# Altium project CameraMainBoard.PrjPcb
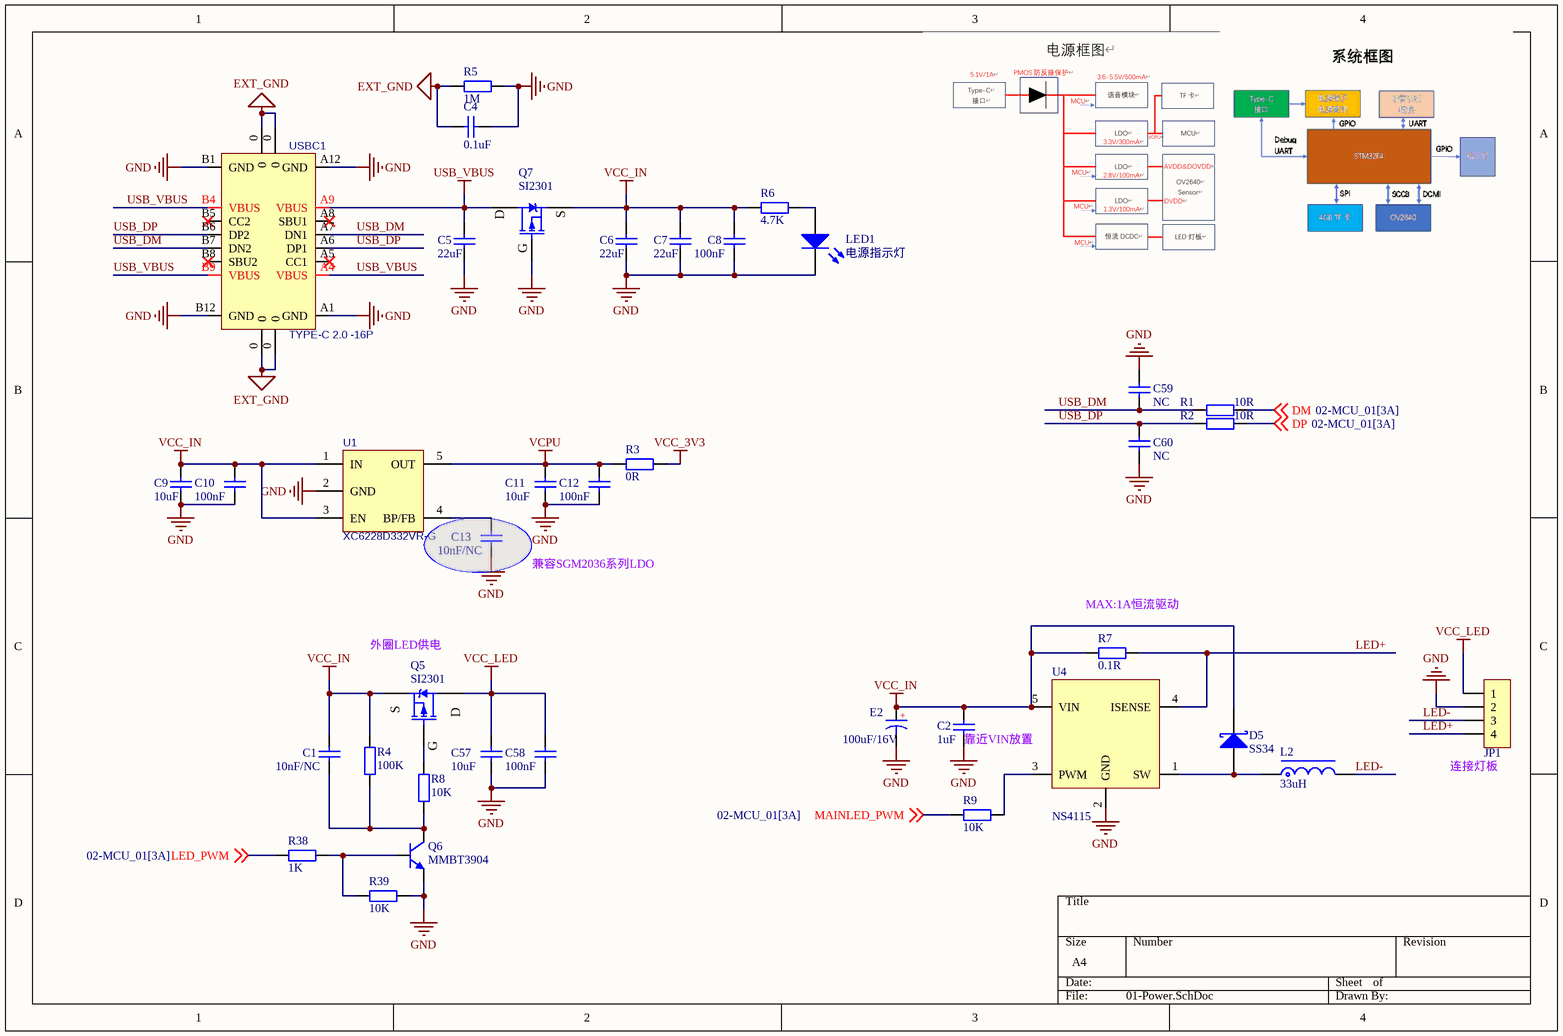
[diagram p0: 01-Power.SchDoc]
5 sheets, 131 parts. Net scope: global (net labels, ports and power ports of the same name join across sheets).
Board file: Camera-M-PCB.PcbDoc
Sheets:
  01-Power.SchDoc
  02-MCU_01.SchDoc
  03-CameraSensor.SchDoc
  04-TFCard_SU03T.SchDoc
  05-MCU_02.SchDoc

## Sheet 01-Power.SchDoc
size A4; SheetNumber: 1; SheetTotal: 5

### Parts
C1  10nF/NC  [C0603_M]
C2  1uF  [C0603_M]
C4  0.1uF  [C0603_M]
C5  22uF  [C0805_M]
C6  22uF  [C0805_M]
C7  22uF  [C0805_M]
C8  100nF  [C0603_M]
C9  10uF  [C0603_M]
C10  100nF  [C0603_M]
C11  10uF  [C0603_M]
C12  100nF  [C0603_M]
C13  10nF/NC  [C0603_M]
C57  10uF  [C0603_M]
C58  100nF  [C0603_M]
C59  NC  [C0402_L]
C60  NC  [C0402_L]
D5  SS34  [SMA]
E2  100uF/16V  [CS 6*6 - B]
JP1  HDR-1X4  [MX1.25-L-4P]  (value not drawn)
L2  33uH  [CDRH74]
LED1  电源指示灯  [LED0603_G]
Q5  SI2301  [SOT23-3N]
Q6  MMBT3904  [SOT23-3N]
Q7  SI2301  [SOT23-3N]
R1  10R  [R0402_M]
R2  10R  [R0402_M]
R3  0R  [R0603_M]
R4  100K  [R0603_M]
R5  1M  [R0603_M]
R6  4.7K  [R0402_M]
R7  0.1R  [R1206_M]
R8  10K  [R0603_M]
R9  10K  [R0603_M]
R38  1K  [R0603_M]
R39  10K  [R0603_M]
U1  XC6228D332VR-G  [SOT-23-5]
U4  NS4115  [SOT89-5M]
USBC1  TYPE-C 2.0 -16P  [USB-C-SMD_16P]

### Nets
EXT_GND: C4.2 R5.2 USBC1.0
GND: C2.1 C4.1 C5.1 C6.1 C7.1 C8.1 C9.1 C10.1 C11.1 C12.1 C13.1 C57.1 C58.1 C59.2 C60.1 E2.2 JP1.2 LED1.2(K) Q6.2(E) Q7.1(G) R5.1 R39.1 U1.2(GND) U4.2(GND) USBC1.A1(GND) USBC1.A12(GND) USBC1.B1(GND) USBC1.B12(GND)
USB_VBUS: C5.2 Q7.3(D) USBC1.A4(VBUS) USBC1.A9(VBUS) USBC1.B4(VBUS) USBC1.B9(VBUS)
VCC_3V3: R3.2
VCC_IN: C1.2 C2.2 C6.2 C7.2 C8.2 C9.2 C10.2 D5.2(K) E2.1 Q5.2(S) Q7.2(S) R4.1 R6.2 R7.1 U1.1(IN) U1.3(EN) U4.5(VIN)
VCC_LED: C57.2 C58.2 JP1.1 Q5.3(D)
VCPU: C11.2 C12.2 R3.1 U1.5(OUT)
DM: R1.1 ; off-sheet DM
DP: R2.1 ; off-sheet DP
LED+: JP1.4 R7.2 U4.4(ISENSE)
LED-: JP1.3 L2.2
LED_PWM: R38.2 ; off-sheet LED_PWM
MAINLED_PWM: R9.1 ; off-sheet MAINLED_PWM
USB_DM: C59.1 R1.2 USBC1.A7(DN1) USBC1.B7(DN2)
USB_DP: C60.2 R2.2 USBC1.A6(DP1) USBC1.B6(DP2)
NetC1_1: C1.1 Q6.3(C) R4.2 R8.2
NetC13_2: C13.2 U1.4(BP/FB)
NetD5_1: D5.1(A) L2.1 U4.1(SW)
NetLED1_1: LED1.1(A) R6.1
NetQ5_1: Q5.1(G) R8.1
NetQ6_1: Q6.1(B) R38.1 R39.2
NetR9_2: R9.2 U4.3(PWM)

Not connected (* = marked no-connect by the designer): USBC1 A5(CC1)* A8(SBU1)* B5(CC2)* B8(SBU2)*

### Notes on the sheet
- 兼容SGM2036系列LDO
- (near Q5) 外圈LED供电
- (near R7) MAX:1A恒流驱动
- (near C2) 靠近VIN放置
- (near JP1) 连接灯板
- (in symbol CS_SMD) +

### Library data of the parts
C1 C2 C4-C13 C57-C60 = C: 贴片电容/MLCC电容; BOM名称: 无极性贴片电容; 当前库版本V2023.8.14 @淘宝卖家:黄晶宝石: 最新版本发布https://item.taobao.com/item.htm?id=566775463719; 联系下单店铺卖家 免费帮你查找封装: 联系下单店铺卖家 免费技术支持
  C1 C13: value: 10nF/NC
  C2: value: 1uF
  C4: value: 0.1uF
  C5-C7: value: 22uF
  C8 C10 C12 C58: value: 100nF
  C9 C11 C57: value: 10uF
  C59 C60: value: NC
D5 = SS34: 肖特基二极管; 属性: 40V/3A; 当前库版本V2023.8.14 @淘宝卖家:黄晶宝石: 最新版本发布https://item.taobao.com/item.htm?id=566775463719; BOM名称: 肖特基二极管
E2 = CS_SMD: 贴片固态电容; 联系下单店铺卖家 免费帮你查找封装: 联系下单店铺卖家 免费技术支持; BOM名称: 贴片固态电容
JP1 = Header 4: 4P连接器; 联系卖家 免费技术支持: 封装库来自淘宝卖家ID：黄晶宝石; BOM名称: 4P连接器
L2 = L-CDRH: CDRH功率屏蔽电感; BOM名称: 功率屏蔽电感; 当前库版本V2023.8.14 @淘宝卖家:黄晶宝石: 最新版本发布https://item.taobao.com/item.htm?id=566775463719; VALUE: 33uH
LED1 = LED: 贴片LED; 封装库来自淘宝卖家：黄晶宝石: 其他店铺购入均为盗版封装库，无更新权益，请立即申请退款，本店现金奖励200~1000元; BOM名称: 贴片LED
Q5 Q7 = SI2301: P沟道 20V/2.8A; BOM名称: P沟道场效应管; 联系下单店铺卖家 免费帮你查找封装: 联系下单店铺卖家 免费技术支持
Q6 = MMBT3904: 高频放大-NPN型; 参数: 40V 0.2A 0.3W 300MHZ; 联系下单店铺卖家 免费帮你查找封装: 联系下单店铺卖家 免费技术支持; BOM名称: 高频放大-NPN型
R1-R7 R9 R38 R39 = R: 贴片电阻; 联系下单店铺卖家 免费帮你查找封装: 联系下单店铺卖家 免费技术支持; BOM名称: 贴片电阻
  R1 R2: value: 10R
  R3: value: 0R
  R4: value: 100K
  R5: value: 1M
  R6: value: 4.7K
  R7: value: 0.1R
  R9 R39: value: 10K
  R38: value: 1K
R8 = R: 贴片电阻; 联系下单店铺卖家 免费帮你查找封装: 联系下单店铺卖家 免费技术支持; value: 1K; BOM名称: 贴片电阻
U1 = SGM2019-1.8YN5G: LDO 1.8V/0.3A; 当前库版本V2023.8.14 @淘宝卖家:黄晶宝石: 最新版本发布https://item.taobao.com/item.htm?id=566775463719; BOM名称: SGM2019-1.8YN5G
U4 = NS4115: NS4115 LED恒流驱动IC，最大输出电流1A，输入支持PWM调光
USBC1 = USB2.0_Type-C_16Pin: USB2.0_Type-C_16Pin母座; 联系下单店铺卖家 免费技术支持: 联系下单店铺卖家 免费帮你查找封装

## Sheet 02-MCU_01.SchDoc
size A4; SheetNumber: 2; SheetTotal: 4
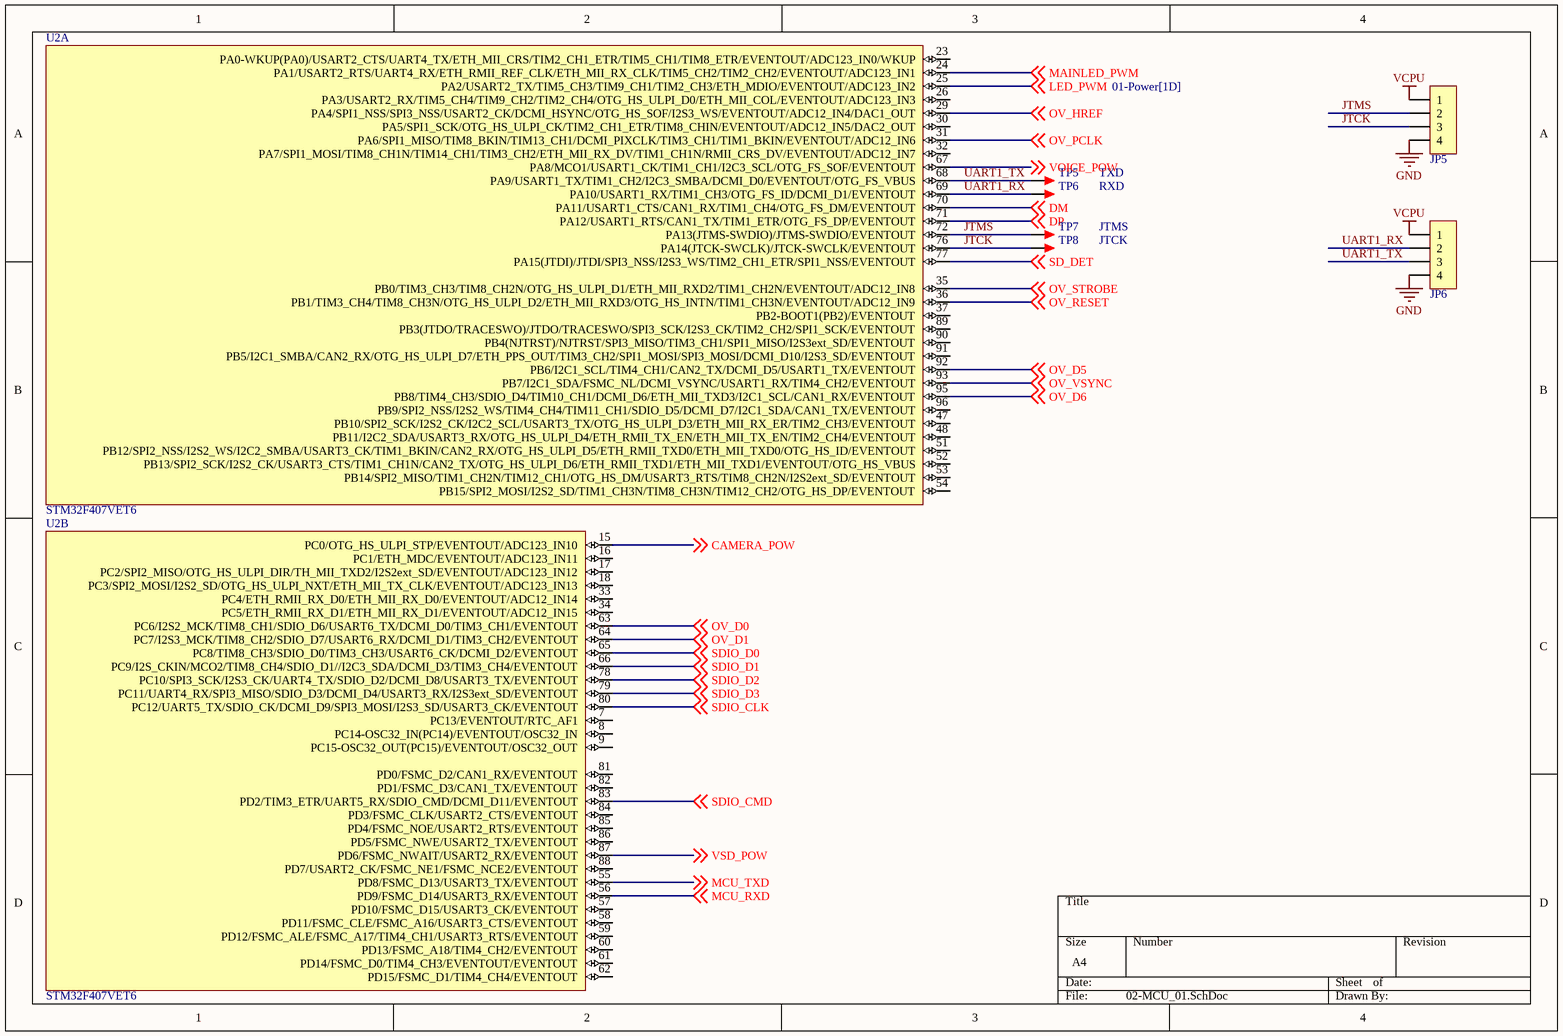
[diagram p1: 02-MCU_01.SchDoc]

### Parts
JP5  HDR-1X4  [MX1.25-LT-4P]  (value not drawn)
JP6  HDR-1X4  [MX1.25-LT-4P]  (value not drawn)
TP5  TXD  [TEST 1.6]
TP6  RXD  [TEST 1.6]
TP7  JTMS  [TEST 1.6]
TP8  JTCK  [TEST 1.6]
U2  STM32F407VET6  [LQFP100_V]  (parts A,B of 5)

### Nets
GND: JP5.4 JP6.4
VCPU: JP5.1 JP6.1
CAMERA_POW: U2.15(PC0/OTG_HS_ULPI_STP/EVENTOUT/ADC123_IN10) ; off-sheet CAMERA_POW
DM: U2.70(PA11/USART1_CTS/CAN1_RX/TIM1_CH4/OTG_FS_DM/EVENTOUT) ; off-sheet DM
DP: U2.71(PA12/USART1_RTS/CAN1_TX/TIM1_ETR/OTG_FS_DP/EVENTOUT) ; off-sheet DP
JTCK: JP5.3 TP8.1 U2.76(PA14(JTCK-SWCLK)/JTCK-SWCLK/EVENTOUT)
JTMS: JP5.2 TP7.1 U2.72(PA13(JTMS-SWDIO)/JTMS-SWDIO/EVENTOUT)
LED_PWM: U2.25(PA2/USART2_TX/TIM5_CH3/TIM9_CH1/TIM2_CH3/ETH_MDIO/EVENTOUT/ADC123_IN2) ; off-sheet LED_PWM
MAINLED_PWM: U2.24(PA1/USART2_RTS/UART4_RX/ETH_RMII_REF_CLK/ETH_MII_RX_CLK/TIM5_CH2/TIM2_CH2/EVENTOUT/ADC123_IN1) ; off-sheet MAINLED_PWM
MCU_RXD: U2.56(PD9/FSMC_D14/USART3_RX/EVENTOUT) ; off-sheet MCU_RXD
MCU_TXD: U2.55(PD8/FSMC_D13/USART3_TX/EVENTOUT) ; off-sheet MCU_TXD
OV_D0: U2.63(PC6/I2S2_MCK/TIM8_CH1/SDIO_D6/USART6_TX/DCMI_D0/TIM3_CH1/EVENTOUT) ; off-sheet OV_D0
OV_D1: U2.64(PC7/I2S3_MCK/TIM8_CH2/SDIO_D7/USART6_RX/DCMI_D1/TIM3_CH2/EVENTOUT) ; off-sheet OV_D1
OV_D5: U2.92(PB6/I2C1_SCL/TIM4_CH1/CAN2_TX/DCMI_D5/USART1_TX/EVENTOUT) ; off-sheet OV_D5
OV_D6: U2.95(PB8/TIM4_CH3/SDIO_D4/TIM10_CH1/DCMI_D6/ETH_MII_TXD3/I2C1_SCL/CAN1_RX/EVENTOUT) ; off-sheet OV_D6
OV_HREF: U2.29(PA4/SPI1_NSS/SPI3_NSS/USART2_CK/DCMI_HSYNC/OTG_HS_SOF/I2S3_WS/EVENTOUT/ADC12_IN4/DAC1_OUT) ; off-sheet OV_HREF
OV_PCLK: U2.31(PA6/SPI1_MISO/TIM8_BKIN/TIM13_CH1/DCMI_PIXCLK/TIM3_CH1/TIM1_BKIN/EVENTOUT/ADC12_IN6) ; off-sheet OV_PCLK
OV_RESET: U2.36(PB1/TIM3_CH4/TIM8_CH3N/OTG_HS_ULPI_D2/ETH_MII_RXD3/OTG_HS_INTN/TIM1_CH3N/EVENTOUT/ADC12_IN9) ; off-sheet OV_RESET
OV_STROBE: U2.35(PB0/TIM3_CH3/TIM8_CH2N/OTG_HS_ULPI_D1/ETH_MII_RXD2/TIM1_CH2N/EVENTOUT/ADC12_IN8) ; off-sheet OV_STROBE
OV_VSYNC: U2.93(PB7/I2C1_SDA/FSMC_NL/DCMI_VSYNC/USART1_RX/TIM4_CH2/EVENTOUT) ; off-sheet OV_VSYNC
SD_DET: U2.77(PA15(JTDI)/JTDI/SPI3_NSS/I2S3_WS/TIM2_CH1_ETR/SPI1_NSS/EVENTOUT) ; off-sheet SD_DET
SDIO_CLK: U2.80(PC12/UART5_TX/SDIO_CK/DCMI_D9/SPI3_MOSI/I2S3_SD/USART3_CK/EVENTOUT) ; off-sheet SDIO_CLK
SDIO_CMD: U2.83(PD2/TIM3_ETR/UART5_RX/SDIO_CMD/DCMI_D11/EVENTOUT) ; off-sheet SDIO_CMD
SDIO_D0: U2.65(PC8/TIM8_CH3/SDIO_D0/TIM3_CH3/USART6_CK/DCMI_D2/EVENTOUT) ; off-sheet SDIO_D0
SDIO_D1: U2.66(PC9/I2S_CKIN/MCO2/TIM8_CH4/SDIO_D1//I2C3_SDA/DCMI_D3/TIM3_CH4/EVENTOUT) ; off-sheet SDIO_D1
SDIO_D2: U2.78(PC10/SPI3_SCK/I2S3_CK/UART4_TX/SDIO_D2/DCMI_D8/USART3_TX/EVENTOUT) ; off-sheet SDIO_D2
SDIO_D3: U2.79(PC11/UART4_RX/SPI3_MISO/SDIO_D3/DCMI_D4/USART3_RX/I2S3ext_SD/EVENTOUT) ; off-sheet SDIO_D3
UART1_RX: JP6.2 TP6.1 U2.69(PA10/USART1_RX/TIM1_CH3/OTG_FS_ID/DCMI_D1/EVENTOUT)
UART1_TX: JP6.3 TP5.1 U2.68(PA9/USART1_TX/TIM1_CH2/I2C3_SMBA/DCMI_D0/EVENTOUT/OTG_FS_VBUS)
VOICE_POW: U2.67(PA8/MCO1/USART1_CK/TIM1_CH1/I2C3_SCL/OTG_FS_SOF/EVENTOUT) ; off-sheet VOICE_POW
VSD_POW: U2.87(PD6/FSMC_NWAIT/USART2_RX/EVENTOUT) ; off-sheet VSD_POW

Not connected (* = marked no-connect by the designer): U2 7(PC13/EVENTOUT/RTC_AF1) 8(PC14-OSC32_IN(PC14)/EVENTOUT/OSC32_IN) 9(PC15-OSC32_OUT(PC15)/EVENTOUT/OSC32_OUT) 16(PC1/ETH_MDC/EVENTOUT/ADC123_IN11) 17(PC2/SPI2_MISO/OTG_HS_ULPI_DIR/TH_MII_TXD2/I2S2ext_SD/EVENTOUT/ADC123_IN12) 18(PC3/SPI2_MOSI/I2S2_SD/OTG_HS_ULPI_NXT/ETH_MII_TX_CLK/EVENTOUT/ADC123_IN13) 23(PA0-WKUP(PA0)/USART2_CTS/UART4_TX/ETH_MII_CRS/TIM2_CH1_ETR/TIM5_CH1/TIM8_ETR/EVENTOUT/ADC123_IN0/WKUP) 26(PA3/USART2_RX/TIM5_CH4/TIM9_CH2/TIM2_CH4/OTG_HS_ULPI_D0/ETH_MII_COL/EVENTOUT/ADC123_IN3) 30(PA5/SPI1_SCK/OTG_HS_ULPI_CK/TIM2_CH1_ETR/TIM8_CHIN/EVENTOUT/ADC12_IN5/DAC2_OUT) 32(PA7/SPI1_MOSI/TIM8_CH1N/TIM14_CH1/TIM3_CH2/ETH_MII_RX_DV/TIM1_CH1N/RMII_CRS_DV/EVENTOUT/ADC12_IN7) 33(PC4/ETH_RMII_RX_D0/ETH_MII_RX_D0/EVENTOUT/ADC12_IN14) 34(PC5/ETH_RMII_RX_D1/ETH_MII_RX_D1/EVENTOUT/ADC12_IN15) 37(PB2-BOOT1(PB2)/EVENTOUT) 47(PB10/SPI2_SCK/I2S2_CK/I2C2_SCL/USART3_TX/OTG_HS_ULPI_D3/ETH_MII_RX_ER/TIM2_CH3/EVENTOUT) 48(PB11/I2C2_SDA/USART3_RX/OTG_HS_ULPI_D4/ETH_RMII_TX_EN/ETH_MII_TX_EN/TIM2_CH4/EVENTOUT) 51(PB12/SPI2_NSS/I2S2_WS/I2C2_SMBA/USART3_CK/TIM1_BKIN/CAN2_RX/OTG_HS_ULPI_D5/ETH_RMII_TXD0/ETH_MII_TXD0/OTG_HS_ID/EVENTOUT) 52(PB13/SPI2_SCK/I2S2_CK/USART3_CTS/TIM1_CH1N/CAN2_TX/OTG_HS_ULPI_D6/ETH_RMII_TXD1/ETH_MII_TXD1/EVENTOUT/OTG_HS_VBUS) 53(PB14/SPI2_MISO/TIM1_CH2N/TIM12_CH1/OTG_HS_DM/USART3_RTS/TIM8_CH2N/I2S2ext_SD/EVENTOUT) 54(PB15/SPI2_MOSI/I2S2_SD/TIM1_CH3N/TIM8_CH3N/TIM12_CH2/OTG_HS_DP/EVENTOUT) 57(PD10/FSMC_D15/USART3_CK/EVENTOUT) 58(PD11/FSMC_CLE/FSMC_A16/USART3_CTS/EVENTOUT) 59(PD12/FSMC_ALE/FSMC_A17/TIM4_CH1/USART3_RTS/EVENTOUT) 60(PD13/FSMC_A18/TIM4_CH2/EVENTOUT) 61(PD14/FSMC_D0/TIM4_CH3/EVENTOUT/EVENTOUT) 62(PD15/FSMC_D1/TIM4_CH4/EVENTOUT) 81(PD0/FSMC_D2/CAN1_RX/EVENTOUT) 82(PD1/FSMC_D3/CAN1_TX/EVENTOUT) 84(PD3/FSMC_CLK/USART2_CTS/EVENTOUT) 85(PD4/FSMC_NOE/USART2_RTS/EVENTOUT) 86(PD5/FSMC_NWE/USART2_TX/EVENTOUT) 88(PD7/USART2_CK/FSMC_NE1/FSMC_NCE2/EVENTOUT) 89(PB3(JTDO/TRACESWO)/JTDO/TRACESWO/SPI3_SCK/I2S3_CK/TIM2_CH2/SPI1_SCK/EVENTOUT) 90(PB4(NJTRST)/NJTRST/SPI3_MISO/TIM3_CH1/SPI1_MISO/I2S3ext_SD/EVENTOUT) 91(PB5/I2C1_SMBA/CAN2_RX/OTG_HS_ULPI_D7/ETH_PPS_OUT/TIM3_CH2/SPI1_MOSI/SPI3_MOSI/DCMI_D10/I2S3_SD/EVENTOUT) 96(PB9/SPI2_NSS/I2S2_WS/TIM4_CH4/TIM11_CH1/SDIO_D5/DCMI_D7/I2C1_SDA/CAN1_TX/EVENTOUT)

### Library data of the parts
JP5 JP6 = Header 4: 4P连接器; 联系卖家 免费技术支持: 封装库来自淘宝卖家ID：黄晶宝石; BOM名称: 4P连接器
TP5-TP8 = TEST: 测试点; 联系下单店铺卖家 免费技术支持: 联系下单店铺卖家 免费帮你查找封装; BOM名称: 测试点
U2 = STM32F407VET6: ARM Cortex-M4 32b MCU+FPU, 210DMIP, 512 kB Flash, 192+4 kB RAM, Camera, 82 I/Os, 100-pin LQFP, -40 to +85癈, Tray; Internal RAM: 192kB; Operating Frequency (Processor Speed): 168MHz; A/D Converter: 16x12-bit; D/A Converter: 2x12-bit; 16-bit Timers (IC/OC/PWM): 12x16-bit(24/24/30); 32-bit Timer (IC/OC/PWM): 2x32-bit (8/8/8); Other Timer Functions: 2xWDG, RTC, 24-bit down counter; Serial Interface: 3xSPI/2xI2S/2xI2C/3xUSART(IrDa, ISO7816)/3xUART/2xUSB OTG FS/HS, 2xCAN/Ethernet MAC10/100, SDIO; DatasheetVersion: rev2, Jan-2012; PackageVersion: 2012; PackageReference: LQFP100; PackageDescription: 100-Pin Low Profile Quad Flat Package, 14x14 mm Body, 0.5 mm Pitch; ComponentLink1Description: Manufacturer URL; ComponentLink1URL: http://www.st.com/; ComponentLink2Description: STM32F405/7 Datasheet; ComponentLink2URL: http://www.st.com/internet/com/TECHNICAL_RESOURCES/TECHNICAL_LITERATURE/DATASHEET/DM00037051.pdf; ComponentLink3Description: STM32F4 Web Page; ComponentLink3URL: http://www.st.com/internet/mcu/subclass/1521.jsp

## Sheet 03-CameraSensor.SchDoc
size A4; SheetNumber: 3; SheetTotal: 5
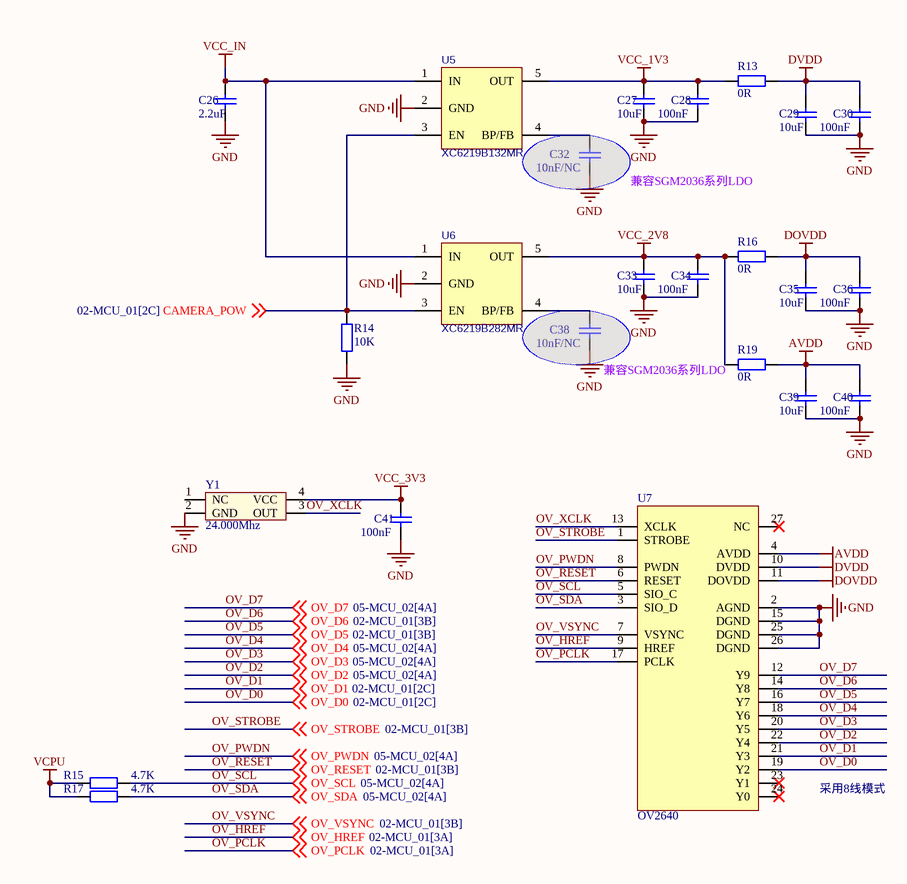
[diagram p2: 03-CameraSensor.SchDoc]

### Parts
C26  2.2uF  [C0603_M]
C27  10uF  [C0603_M]
C28  100nF  [C0603_M]
C29  10uF  [C0603_M]
C30  100nF  [C0603_M]
C32  10nF/NC  [C0603_M]
C33  10uF  [C0603_M]
C34  100nF  [C0603_M]
C35  10uF  [C0603_M]
C36  100nF  [C0603_M]
C38  10nF/NC  [C0603_M]
C39  10uF  [C0603_M]
C40  100nF  [C0603_M]
C41  100nF  [C0603_M]
R13  0R  [R0603_M]
R14  10K  [R0603_M]
R15  4.7K  [R0402_M]
R16  0R  [R0603_M]
R17  4.7K  [R0402_M]
R19  0R  [R0603_M]
U5  XC6219B132MR  [SOT-23-5]
U6  XC6219B282MR  [SOT-23-5]
U7  OV2640  [OV2640-24]
Y1  24.000Mhz  [XTAL3225]

### Nets
AVDD: C39.2 C40.2 R19.2 U7.4(AVDD)
DOVDD: C35.2 C36.2 R16.2 U7.11(DOVDD)
DVDD: C29.2 C30.2 R13.2 U7.10(DVDD)
GND: C26.1 C27.1 C28.1 C29.1 C30.1 C32.1 C33.1 C34.1 C35.1 C36.1 C38.1 C39.1 C40.1 C41.1 R14.1 U5.2(GND) U6.2(GND) U7.2(AGND) U7.15(DGND) U7.25(DGND) U7.26(DGND) Y1.2(GND)
VCC_1V3: C27.2 C28.2 R13.1 U5.5(OUT)
VCC_2V8: C33.2 C34.2 R16.1 R19.1 U6.5(OUT)
VCC_3V3: C41.2 Y1.4(VCC)
VCC_IN: C26.2 U5.1(IN) U6.1(IN)
VCPU: R15.2 R17.2
CAMERA_POW: R14.2 U5.3(EN) U6.3(EN) ; off-sheet CAMERA_POW
OV_D0: U7.19(Y2) ; off-sheet OV_D0
OV_D1: U7.21(Y3) ; off-sheet OV_D1
OV_D2: U7.22(Y4) ; off-sheet OV_D2
OV_D3: U7.20(Y5) ; off-sheet OV_D3
OV_D4: U7.18(Y6) ; off-sheet OV_D4
OV_D5: U7.16(Y7) ; off-sheet OV_D5
OV_D6: U7.14(Y8) ; off-sheet OV_D6
OV_D7: U7.12(Y9) ; off-sheet OV_D7
OV_HREF: U7.9(HREF) ; off-sheet OV_HREF
OV_PCLK: U7.17(PCLK) ; off-sheet OV_PCLK
OV_PWDN: U7.8(PWDN) ; off-sheet OV_PWDN
OV_RESET: U7.6(RESET) ; off-sheet OV_RESET
OV_SCL: R15.1 U7.5(SIO_C) ; off-sheet OV_SCL
OV_SDA: R17.1 U7.3(SIO_D) ; off-sheet OV_SDA
OV_STROBE: U7.1(STROBE) ; off-sheet OV_STROBE
OV_VSYNC: U7.7(VSYNC) ; off-sheet OV_VSYNC
OV_XCLK: U7.13(XCLK) Y1.3(OUT)
NetC32_2: C32.2 U5.4(BP/FB)
NetC38_2: C38.2 U6.4(BP/FB)

Not connected (* = marked no-connect by the designer): U7 23(Y1)* 24(Y0)* 27(NC)*; Y1 1(NC)

### Notes on the sheet
- 兼容SGM2036系列LDO
- (near C38) 兼容SGM2036系列LDO
- 采用8线模式

### Library data of the parts
C26-C30 C32-C36 C38-C41 = C: as C1 on sheet 01-Power
  C26: value: 2.2uF
  C27 C29 C33 C35 C39: value: 10uF
  C28 C30 C34 C36 C40 C41: value: 100nF
  C32 C38: value: 10nF/NC
R13-R17 R19 = R: 贴片电阻; 联系下单店铺卖家 免费帮你查找封装: 联系下单店铺卖家 免费技术支持; BOM名称: 贴片电阻
  R13 R16 R19: value: 0R
  R14: value: 10K
  R15 R17: value: 4.7K
U5 U6 = SGM2019-1.8YN5G: as U1 on sheet 01-Power; BOM名称: SGM2019-1.8YN5G
Y1 = XTAL_S: 有源晶振

## Sheet 04-TFCard_SU03T.SchDoc
size A4; SheetNumber: 3; SheetTotal: 4
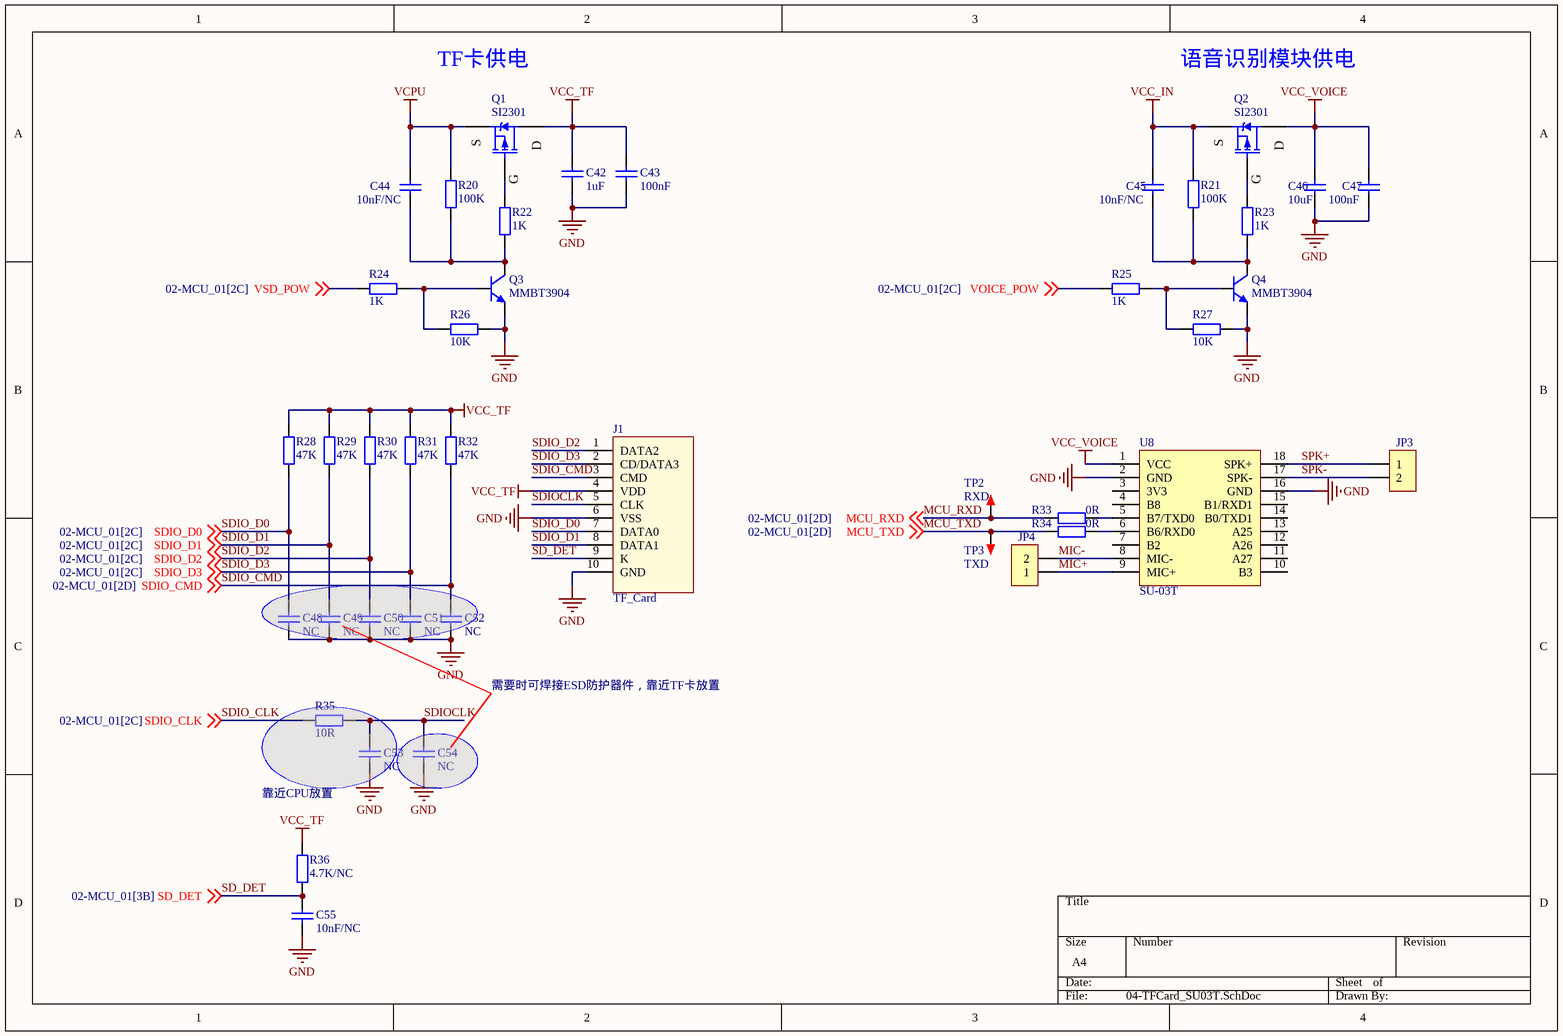
[diagram p3: 04-TFCard_SU03T.SchDoc]

### Parts
C42  1uF  [C0603_M]
C43  100nF  [C0603_M]
C44  10nF/NC  [C0603_M]
C45  10nF/NC  [C0603_M]
C46  10uF  [C0603_M]
C47  100nF  [C0603_M]
C48  NC  [C0402_L]
C49  NC  [C0402_L]
C50  NC  [C0402_L]
C51  NC  [C0402_L]
C52  NC  [C0402_L]
C53  NC  [C0603_M]
C54  NC  [C0402_L]
C55  10nF/NC  [C0603_M]
J1  TF_Card  [Micro SD]
JP3  HDR-1X2  [MX1.25-WT-2P]  (value not drawn)
JP4  HDR-1X2  [MX1.25-WT-2P]  (value not drawn)
Q1  SI2301  [SOT23-3N]
Q2  SI2301  [SOT23-3N]
Q3  MMBT3904  [SOT23-3N]
Q4  MMBT3904  [SOT23-3N]
R20  100K  [R0603_M]
R21  100K  [R0603_M]
R22  1K  [R0603_M]
R23  1K  [R0603_M]
R24  1K  [R0603_M]
R25  1K  [R0603_M]
R26  10K  [R0603_M]
R27  10K  [R0603_M]
R28  47K  [R0603_M]
R29  47K  [R0603_M]
R30  47K  [R0603_M]
R31  47K  [R0603_M]
R32  47K  [R0603_M]
R33  0R  [R0603_M]
R34  0R  [R0603_M]
R35  10R  [R0603_M]
R36  4.7K/NC  [R0603_M]
TP2  RXD  [TEST 1.6]
TP3  TXD  [TEST 1.6]
U8  SU-03T  [SU-03T]

### Nets
GND: C42.1 C43.1 C46.1 C47.1 C48.1 C49.1 C50.1 C51.1 C52.1 C53.1 C54.1 C55.1 J1.6(VSS) J1.10(GND) Q3.2(E) Q4.2(E) R26.1 R27.1 U8.2(GND) U8.16(GND)
VCC_IN: C45.2 Q2.2(S) R21.1
VCC_TF: C42.2 C43.2 J1.4(VDD) Q1.3(D) R28.1 R29.1 R30.1 R31.1 R32.1 R36.1
VCC_VOICE: C46.2 C47.2 Q2.3(D) U8.1(VCC)
VCPU: C44.2 Q1.2(S) R20.1
MCU_RXD: R33.2 TP2.1 ; off-sheet MCU_RXD
MCU_TXD: R34.2 TP3.1 ; off-sheet MCU_TXD
MIC+: JP4.1 U8.9(MIC+)
MIC-: JP4.2 U8.8(MIC-)
SD_DET: C55.2 J1.9(K) R36.2 ; off-sheet SD_DET
SDIO_CLK: R35.2 ; off-sheet SDIO_CLK
SDIO_CMD: C52.2 J1.3(CMD) R32.2 ; off-sheet SDIO_CMD
SDIO_D0: C48.2 J1.7(DATA0) R28.2 ; off-sheet SDIO_D0
SDIO_D1: C49.2 J1.8(DATA1) R29.2 ; off-sheet SDIO_D1
SDIO_D2: C50.2 J1.1(DATA2) R30.2 ; off-sheet SDIO_D2
SDIO_D3: C51.2 J1.2(CD/DATA3) R31.2 ; off-sheet SDIO_D3
SDIOCLK: C53.2 C54.2 J1.5(CLK) R35.1
SPK+: JP3.1 U8.18(SPK+)
SPK-: JP3.2 U8.17(SPK-)
VOICE_POW: R25.2 ; off-sheet VOICE_POW
VSD_POW: R24.2 ; off-sheet VSD_POW
NetC44_1: C44.1 Q3.3(C) R20.2 R22.2
NetC45_1: C45.1 Q4.3(C) R21.2 R23.2
NetQ1_1: Q1.1(G) R22.1
NetQ2_1: Q2.1(G) R23.1
NetQ3_1: Q3.1(B) R24.1 R26.2
NetQ4_1: Q4.1(B) R25.1 R27.2
NetR33_1: R33.1 U8.5(B7/TXD0)
NetR34_1: R34.1 U8.6(B6/RXD0)

Not connected (* = marked no-connect by the designer): U8 3(3V3) 4(B8) 7(B2) 10(B3) 11(A27) 12(A26) 13(A25) 14(B0/TXD1) 15(B1/RXD1)

### Notes on the sheet
- TF卡供电
- 语音识别模块供电
- 需要时可焊接ESD防护器件，靠近TF卡放置
- 靠近CPU放置

### Library data of the parts
C42-C55 = C: as C1 on sheet 01-Power
  C42: value: 1uF
  C43 C47: value: 100nF
  C44 C45 C55: value: 10nF/NC
  C46: value: 10uF
  C48-C54: value: NC
J1 = TF_Card: TF卡座; 当前库版本V2023.8.14 @淘宝卖家:黄晶宝石: 最新版本发布https://item.taobao.com/item.htm?id=566775463719; BOM名称: TF卡座
JP3 JP4 = Header 2: 2P连接器; 联系卖家 免费技术支持: 封装库来自淘宝卖家ID：黄晶宝石; BOM名称: 2P连接器
Q1 Q2 = SI2301: as Q5 on sheet 01-Power
Q3 Q4 = MMBT3904: as Q6 on sheet 01-Power; BOM名称: 高频放大-NPN型
R20-R36 = R: 贴片电阻; 联系下单店铺卖家 免费帮你查找封装: 联系下单店铺卖家 免费技术支持; BOM名称: 贴片电阻
  R20 R21: value: 100K
  R22-R25: value: 1K
  R26 R27: value: 10K
  R28-R32: value: 47K
  R33 R34: value: 0R
  R35: value: 10R
  R36: value: 4.7K/NC
TP2 TP3 = TEST: 测试点; 联系下单店铺卖家 免费技术支持: 联系下单店铺卖家 免费帮你查找封装; BOM名称: 测试点
U8 = SU-03T: 离线语音识别模块V1.8

## Sheet 05-MCU_02.SchDoc
size A4; SheetNumber: 4; SheetTotal: 5
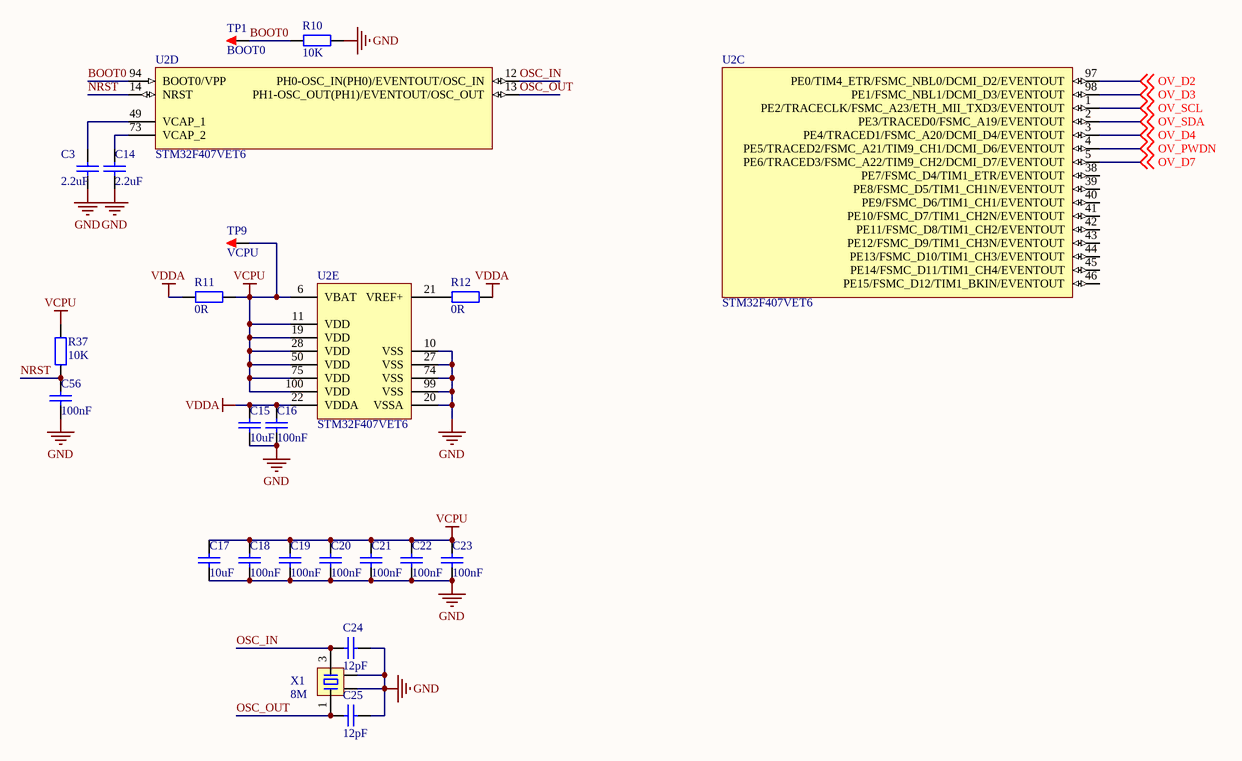
[diagram p4: 05-MCU_02.SchDoc]

### Parts
C3  2.2uF  [C0603_M]
C14  2.2uF  [C0603_M]
C15  10uF  [C0603_M]
C16  100nF  [C0603_M]
C17  10uF  [C0603_M]
C18  100nF  [C0603_M]
C19  100nF  [C0603_M]
C20  100nF  [C0603_M]
C21  100nF  [C0603_M]
C22  100nF  [C0603_M]
C23  100nF  [C0603_M]
C24  12pF  [C0603_M]
C25  12pF  [C0603_M]
C56  100nF  [C0603_M]
R10  10K  [R0603_M]
R11  0R  [R0603_M]
R12  0R  [R0603_M]
R37  10K  [R0603_M]
TP1  BOOT0  [TEST 1.6]
TP9  VCPU  [TEST 1.6]
U2  STM32F407VET6  [LQFP100_V]  (parts C,D,E of 5)
X1  8M  [XTAL-3225-4P]

### Nets
GND: C3.2 C14.2 C15.2 C16.2 C17.2 C18.2 C19.2 C20.2 C21.2 C22.2 C23.2 C24.2 C25.2 C56.2 R10.1 U2.10(VSS) U2.20(VSSA) U2.27(VSS) U2.74(VSS) U2.99(VSS) X1.2 X1.4
VCPU: C17.1 C18.1 C19.1 C20.1 C21.1 C22.1 C23.1 R11.1 R37.2 TP9.1 U2.6(VBAT) U2.11(VDD) U2.19(VDD) U2.28(VDD) U2.50(VDD) U2.75(VDD) U2.100(VDD)
VDDA: C15.1 C16.1 R11.2 R12.1 U2.22(VDDA)
BOOT0: R10.2 TP1.1 U2.94(BOOT0/VPP)
NRST: C56.1 R37.1 U2.14(NRST)
OSC_IN: C24.1 U2.12(PH0-OSC_IN(PH0)/EVENTOUT/OSC_IN) X1.3
OSC_OUT: C25.1 U2.13(PH1-OSC_OUT(PH1)/EVENTOUT/OSC_OUT) X1.1
OV_D2: U2.97(PE0/TIM4_ETR/FSMC_NBL0/DCMI_D2/EVENTOUT) ; off-sheet OV_D2
OV_D3: U2.98(PE1/FSMC_NBL1/DCMI_D3/EVENTOUT) ; off-sheet OV_D3
OV_D4: U2.3(PE4/TRACED1/FSMC_A20/DCMI_D4/EVENTOUT) ; off-sheet OV_D4
OV_D7: U2.5(PE6/TRACED3/FSMC_A22/TIM9_CH2/DCMI_D7/EVENTOUT) ; off-sheet OV_D7
OV_PWDN: U2.4(PE5/TRACED2/FSMC_A21/TIM9_CH1/DCMI_D6/EVENTOUT) ; off-sheet OV_PWDN
OV_SCL: U2.1(PE2/TRACECLK/FSMC_A23/ETH_MII_TXD3/EVENTOUT) ; off-sheet OV_SCL
OV_SDA: U2.2(PE3/TRACED0/FSMC_A19/EVENTOUT) ; off-sheet OV_SDA
NetC3_1: C3.1 U2.49(VCAP_1)
NetC14_1: C14.1 U2.73(VCAP_2)
NetR12_2: R12.2 U2.21(VREF+)

Not connected (* = marked no-connect by the designer): U2 38(PE7/FSMC_D4/TIM1_ETR/EVENTOUT) 39(PE8/FSMC_D5/TIM1_CH1N/EVENTOUT) 40(PE9/FSMC_D6/TIM1_CH1/EVENTOUT) 41(PE10/FSMC_D7/TIM1_CH2N/EVENTOUT) 42(PE11/FSMC_D8/TIM1_CH2/EVENTOUT) 43(PE12/FSMC_D9/TIM1_CH3N/EVENTOUT) 44(PE13/FSMC_D10/TIM1_CH3/EVENTOUT) 45(PE14/FSMC_D11/TIM1_CH4/EVENTOUT) 46(PE15/FSMC_D12/TIM1_BKIN/EVENTOUT)

### Library data of the parts
C3 C14-C25 C56 = C: as C1 on sheet 01-Power
  C3 C14: value: 2.2uF
  C15 C17: value: 10uF
  C16 C18-C23 C56: value: 100nF
  C24 C25: value: 12pF
R10-R12 R37 = R: 贴片电阻; 联系下单店铺卖家 免费帮你查找封装: 联系下单店铺卖家 免费技术支持; BOM名称: 贴片电阻
  R10 R37: value: 10K
  R11 R12: value: 0R
TP1 TP9 = TEST: 测试点; 联系下单店铺卖家 免费技术支持: 联系下单店铺卖家 免费帮你查找封装; BOM名称: 测试点
U2 = STM32F407VET6: as U2 on sheet 02-MCU_01; DatasheetVersion: rev2, Jan-2012; PackageVersion: 2012; PackageReference: LQFP100; PackageDescription: 100-Pin Low Profile Quad Flat Package, 14x14 mm Body, 0.5 mm Pitch; ComponentLink1Description: Manufacturer URL; ComponentLink1URL: http://www.st.com/; ComponentLink2Description: STM32F405/7 Datasheet; ComponentLink2URL: http://www.st.com/internet/com/TECHNICAL_RESOURCES/TECHNICAL_LITERATURE/DATASHEET/DM00037051.pdf; ComponentLink3Description: STM32F4 Web Page; ComponentLink3URL: http://www.st.com/internet/mcu/subclass/1521.jsp
X1 = XTAL-4P: 4脚无源晶振(谐振器）; 联系下单店铺卖家 免费帮你查找封装: 联系下单店铺卖家 免费技术支持; BOM名称: 4脚无源晶振(谐振器）

## Nets that join several sheets
GND: 01-Power (28 pins), 02-MCU_01 (JP5.4 JP6.4), 03-CameraSensor (22 pins), 04-TFCard_SU03T (20 pins), 05-MCU_02 (22 pins)
VCC_3V3: 01-Power (R3.2), 03-CameraSensor (C41.2 Y1.4)
VCC_IN: 01-Power (17 pins), 03-CameraSensor (C26.2 U5.1 U6.1), 04-TFCard_SU03T (C45.2 Q2.2 R21.1)
VCPU: 01-Power (C11.2 C12.2 R3.1 U1.5), 02-MCU_01 (JP5.1 JP6.1), 03-CameraSensor (R15.2 R17.2), 04-TFCard_SU03T (C44.2 Q1.2 R20.1), 05-MCU_02 (17 pins)
CAMERA_POW: 02-MCU_01 (U2.15), 03-CameraSensor (R14.2 U5.3 U6.3)
DM: 01-Power (R1.1), 02-MCU_01 (U2.70)
DP: 01-Power (R2.1), 02-MCU_01 (U2.71)
LED_PWM: 01-Power (R38.2), 02-MCU_01 (U2.25)
MAINLED_PWM: 01-Power (R9.1), 02-MCU_01 (U2.24)
MCU_RXD: 02-MCU_01 (U2.56), 04-TFCard_SU03T (R33.2 TP2.1)
MCU_TXD: 02-MCU_01 (U2.55), 04-TFCard_SU03T (R34.2 TP3.1)
OV_D0: 02-MCU_01 (U2.63), 03-CameraSensor (U7.19)
OV_D1: 02-MCU_01 (U2.64), 03-CameraSensor (U7.21)
OV_D2: 03-CameraSensor (U7.22), 05-MCU_02 (U2.97)
OV_D3: 03-CameraSensor (U7.20), 05-MCU_02 (U2.98)
OV_D4: 03-CameraSensor (U7.18), 05-MCU_02 (U2.3)
OV_D5: 02-MCU_01 (U2.92), 03-CameraSensor (U7.16)
OV_D6: 02-MCU_01 (U2.95), 03-CameraSensor (U7.14)
OV_D7: 03-CameraSensor (U7.12), 05-MCU_02 (U2.5)
OV_HREF: 02-MCU_01 (U2.29), 03-CameraSensor (U7.9)
OV_PCLK: 02-MCU_01 (U2.31), 03-CameraSensor (U7.17)
OV_PWDN: 03-CameraSensor (U7.8), 05-MCU_02 (U2.4)
OV_RESET: 02-MCU_01 (U2.36), 03-CameraSensor (U7.6)
OV_SCL: 03-CameraSensor (R15.1 U7.5), 05-MCU_02 (U2.1)
OV_SDA: 03-CameraSensor (R17.1 U7.3), 05-MCU_02 (U2.2)
OV_STROBE: 02-MCU_01 (U2.35), 03-CameraSensor (U7.1)
OV_VSYNC: 02-MCU_01 (U2.93), 03-CameraSensor (U7.7)
SD_DET: 02-MCU_01 (U2.77), 04-TFCard_SU03T (C55.2 J1.9 R36.2)
SDIO_CLK: 02-MCU_01 (U2.80), 04-TFCard_SU03T (R35.2)
SDIO_CMD: 02-MCU_01 (U2.83), 04-TFCard_SU03T (C52.2 J1.3 R32.2)
SDIO_D0: 02-MCU_01 (U2.65), 04-TFCard_SU03T (C48.2 J1.7 R28.2)
SDIO_D1: 02-MCU_01 (U2.66), 04-TFCard_SU03T (C49.2 J1.8 R29.2)
SDIO_D2: 02-MCU_01 (U2.78), 04-TFCard_SU03T (C50.2 J1.1 R30.2)
SDIO_D3: 02-MCU_01 (U2.79), 04-TFCard_SU03T (C51.2 J1.2 R31.2)
VOICE_POW: 02-MCU_01 (U2.67), 04-TFCard_SU03T (R25.2)
VSD_POW: 02-MCU_01 (U2.87), 04-TFCard_SU03T (R24.2)